# EAGLE design GERMO (EAGLE 9.4.2)
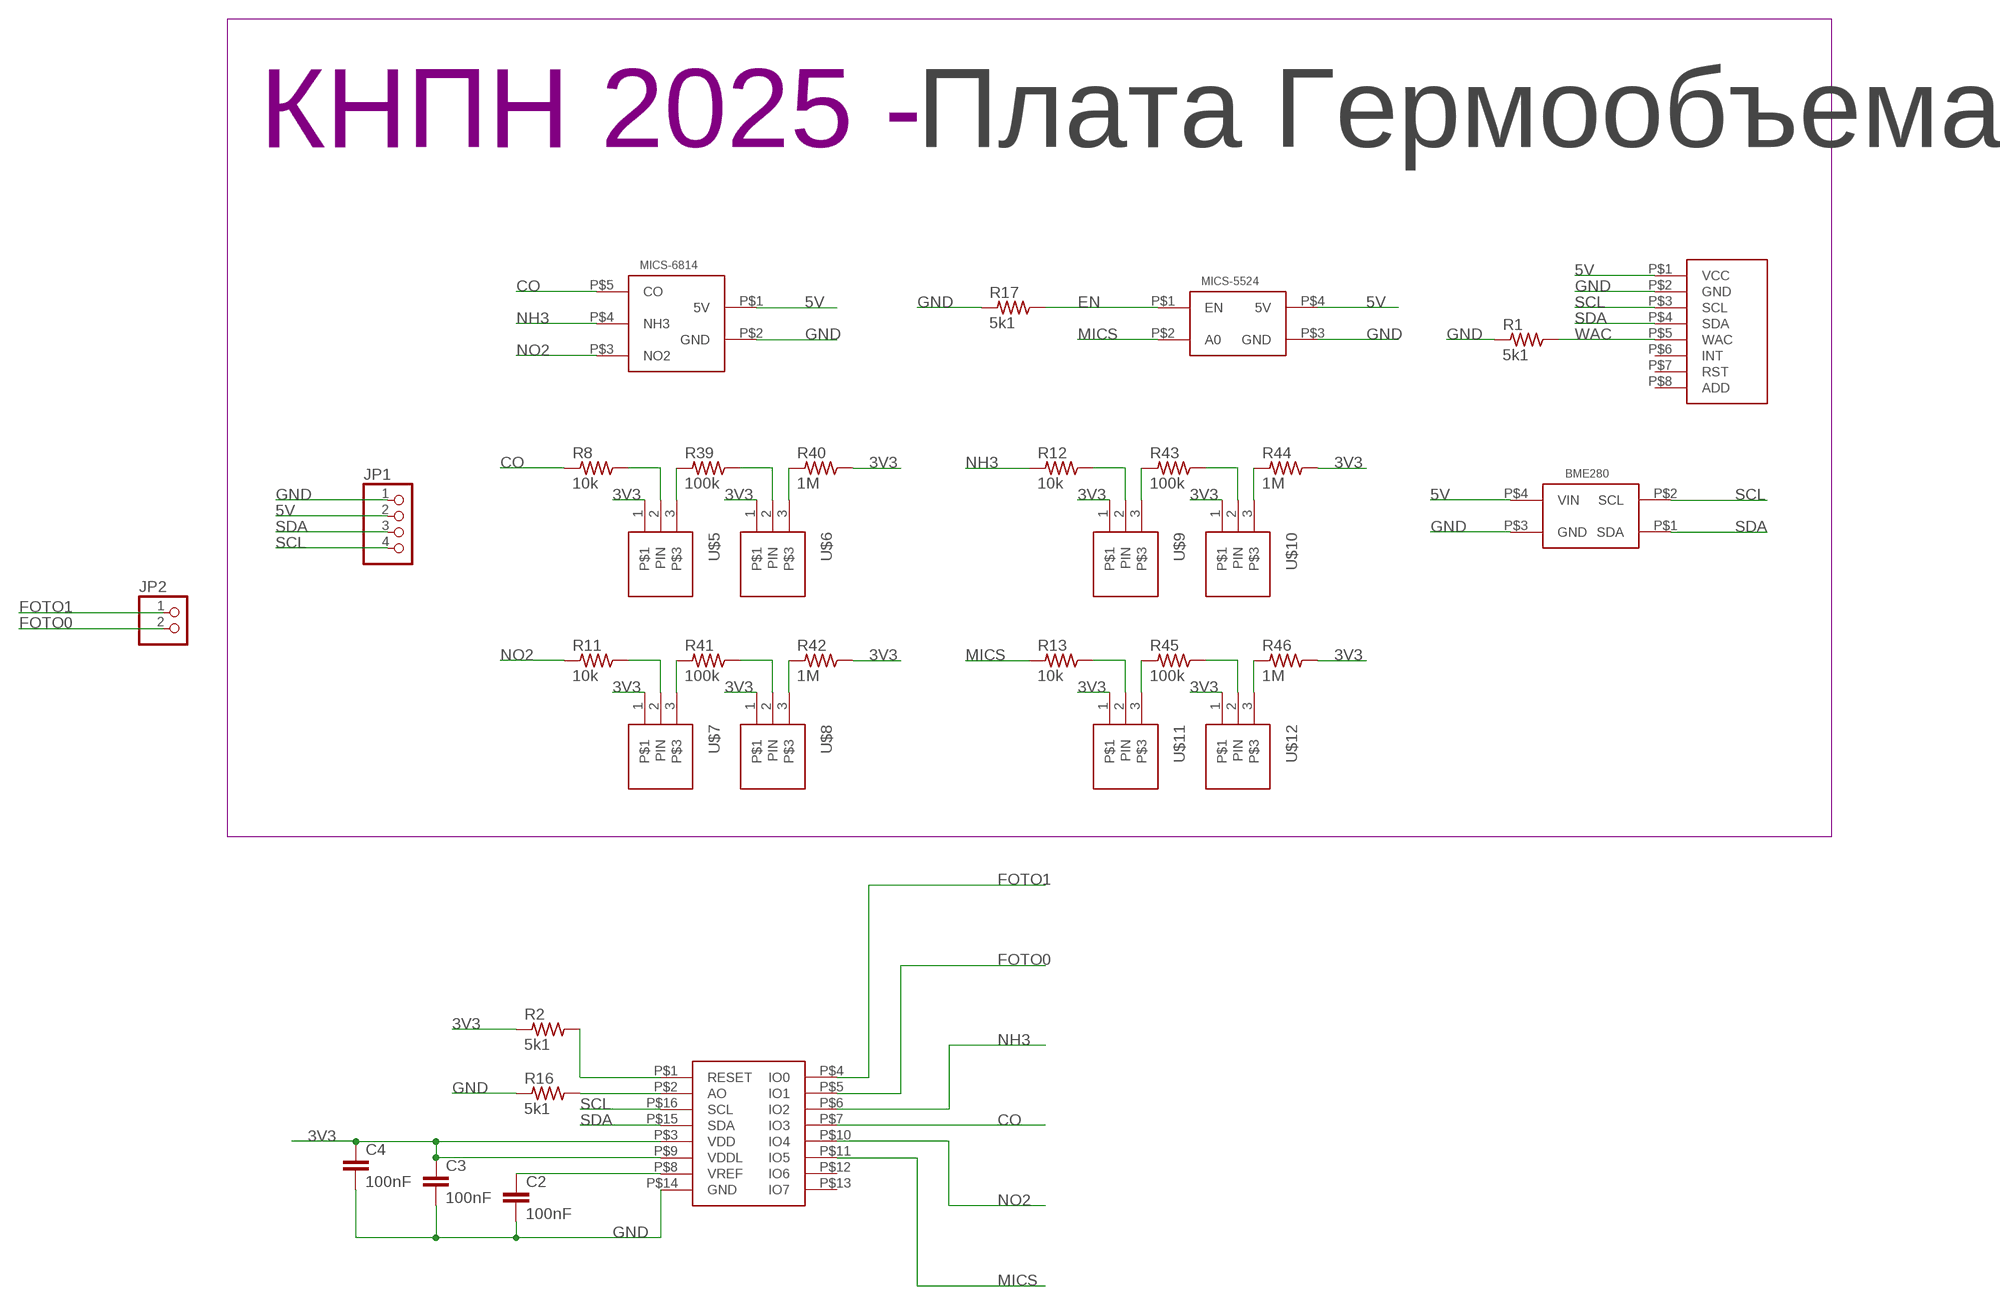
[diagram p0: schematic, sheet 1]

## Parts
BME280  BME280BME280-PINS-ONLY  [BME280-PINS-ONLY]
C2  100nF  C-EUC0603  [C0603]
C3  100nF  C-EUC0603  [C0603]
C4  100nF  C-EUC0603  [C0603]
CCS811  CCS811  [CSS811]
JP1  PINHD-1X4  [1X04]
JP2  PINHD-1X2  [1X02]
MICS-5524  MICS_5524  [MICS-5524]
MICS-6814  MICS-6814  [MICS-6814]
R1  5k1  R-US_R0603  [R0603]
R2  5k1  R-US_R0603  [R0603]
R8  10k  R-US_R0603  [R0603]
R11  10k  R-US_R0603  [R0603]
R12  10k  R-US_R0603  [R0603]
R13  10k  R-US_R0603  [R0603]
R16  5k1  R-US_R0603  [R0603]
R17  5k1  R-US_R0603  [R0603]
R39  100k  R-US_R0603  [R0603]
R40  1M  R-US_R0603  [R0603]
R41  100k  R-US_R0603  [R0603]
R42  1M  R-US_R0603  [R0603]
R43  100k  R-US_R0603  [R0603]
R44  1M  R-US_R0603  [R0603]
R45  100k  R-US_R0603  [R0603]
R46  1M  R-US_R0603  [R0603]
U$2  Плата Гермообъема  LOGOPCB-""  [LOGO]
U$5  CONNECT_3  [CONNECT_3]
U$6  CONNECT_3  [CONNECT_3]
U$7  CONNECT_3  [CONNECT_3]
U$8  CONNECT_3  [CONNECT_3]
U$9  CONNECT_3  [CONNECT_3]
U$10  CONNECT_3  [CONNECT_3]
U$11  CONNECT_3  [CONNECT_3]
U$12  CONNECT_3  [CONNECT_3]
U$14  AD5593  [AD5593]

## Nets
3V3: C3.1 C4.1 R2.2 R40.1 R42.1 R44.1 R46.1 U$5.1 U$6.1 U$7.1 U$8.1 U$9.1 U$10.1 U$11.1 U$12.1 U$14.P$3(VDD) U$14.P$9(VDDL)
5V: BME280.P$4(VIN) CCS811.P$1(VCC) JP1.2 MICS-5524.P$4(5V) MICS-6814.P$1(5V)
CO: MICS-6814.P$5(CO) R8.2 U$14.P$7(IO3)
EN: MICS-5524.P$1(EN) R17.1
FOTO0: JP2.2 U$14.P$5(IO1)
FOTO1: JP2.1 U$14.P$4(IO0)
GND: BME280.P$3(GND) C2.2 C3.2 C4.2 CCS811.P$2(GND) JP1.1 MICS-5524.P$3(GND) MICS-6814.P$2(GND) R1.2 R16.2 R17.2 U$14.P$14(GND)
MICS: MICS-5524.P$2(A0) R13.2 U$14.P$11(IO5)
N$1: R39.2 U$5.3
N$2: R8.1 U$5.2(PIN)
N$3: R40.2 U$6.3
N$4: R39.1 U$6.2(PIN)
N$5: R41.2 U$7.3
N$6: R11.1 U$7.2(PIN)
N$7: R42.2 U$8.3
N$8: R41.1 U$8.2(PIN)
N$9: R43.2 U$9.3
N$10: R12.1 U$9.2(PIN)
N$11: R44.2 U$10.3
N$12: R43.1 U$10.2(PIN)
N$13: R45.2 U$11.3
N$14: R13.1 U$11.2(PIN)
N$15: R46.2 U$12.3
N$16: R45.1 U$12.2(PIN)
N$18: C2.1 U$14.P$8(VREF)
N$19: R16.1 U$14.P$2(AO)
N$20: R2.1 U$14.P$1(RESET)
NH3: MICS-6814.P$4(NH3) R12.2 U$14.P$6(IO2)
NO2: MICS-6814.P$3(NO2) R11.2 U$14.P$10(IO4)
SCL: BME280.P$2(SCL) CCS811.P$3(SCL) JP1.4 U$14.P$16(SCL)
SDA: BME280.P$1(SDA) CCS811.P$4(SDA) JP1.3 U$14.P$15(SDA)
WAC: CCS811.P$5(WAC) R1.1
Unconnected: CCS811.P$6(INT) CCS811.P$7(RST) CCS811.P$8(ADD) U$14.P$12(IO6) U$14.P$13(IO7)

## Library data of the parts
BME280 = UNKNOWN-2024:BME280
C2-C4 = rcl:C-EU: CAPACITOR, European symbol; SPICEPREFIX: C
CCS811 = UNKNOWN-2024:CCS811
JP1 = pinhead:PINHD-1X4: PIN HEADER
JP2 = pinhead:PINHD-1X2: PIN HEADER
MICS-5524 = UNKNOWN-2024:MICS_5524
MICS-6814 = CanCubeSat:MICS-6814
R1 R2 R8 R11-R13 R16 R17 R39-R46 = rcl:R-US_: RESISTOR, American symbol; SPICEPREFIX: R
U$2 = UNKNOWN-2024:LOGO
U$5-U$12 = UNKNOWN-2024:CONNECT_3
U$14 = UNKNOWN-2024:AD5593

## Board
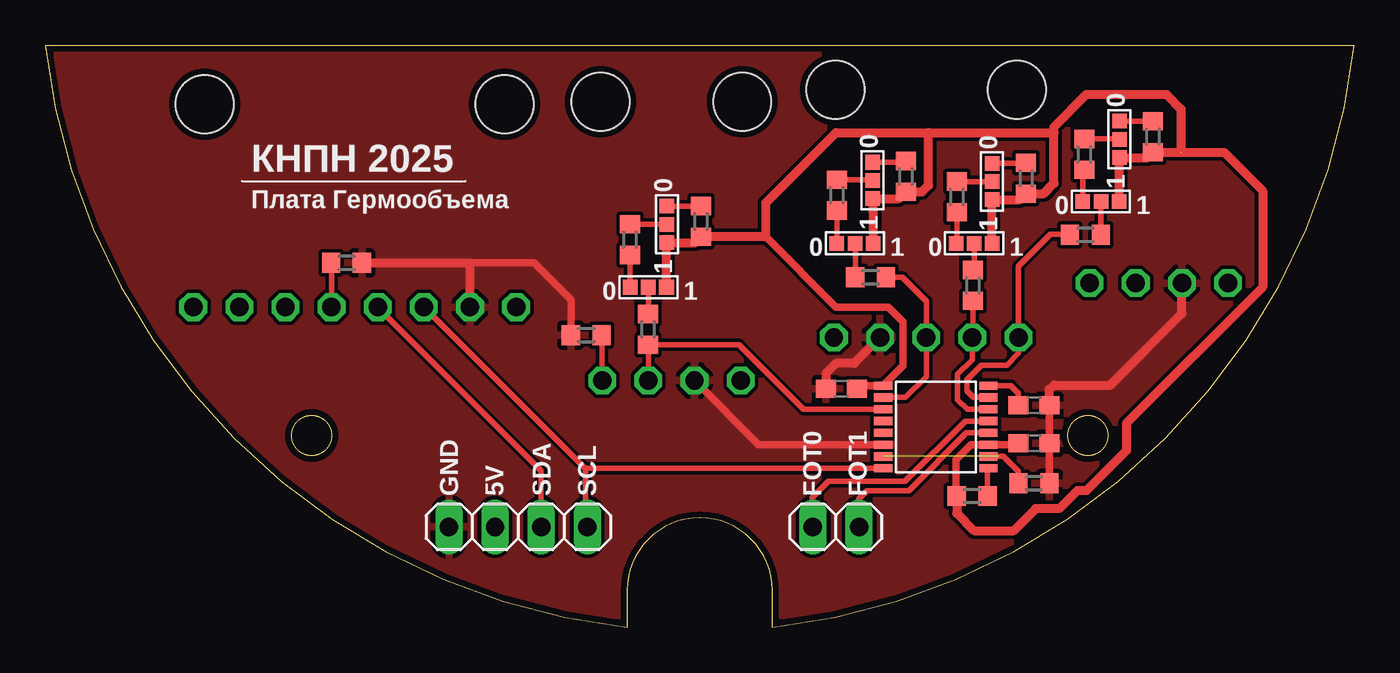
[diagram p1: board, top side]
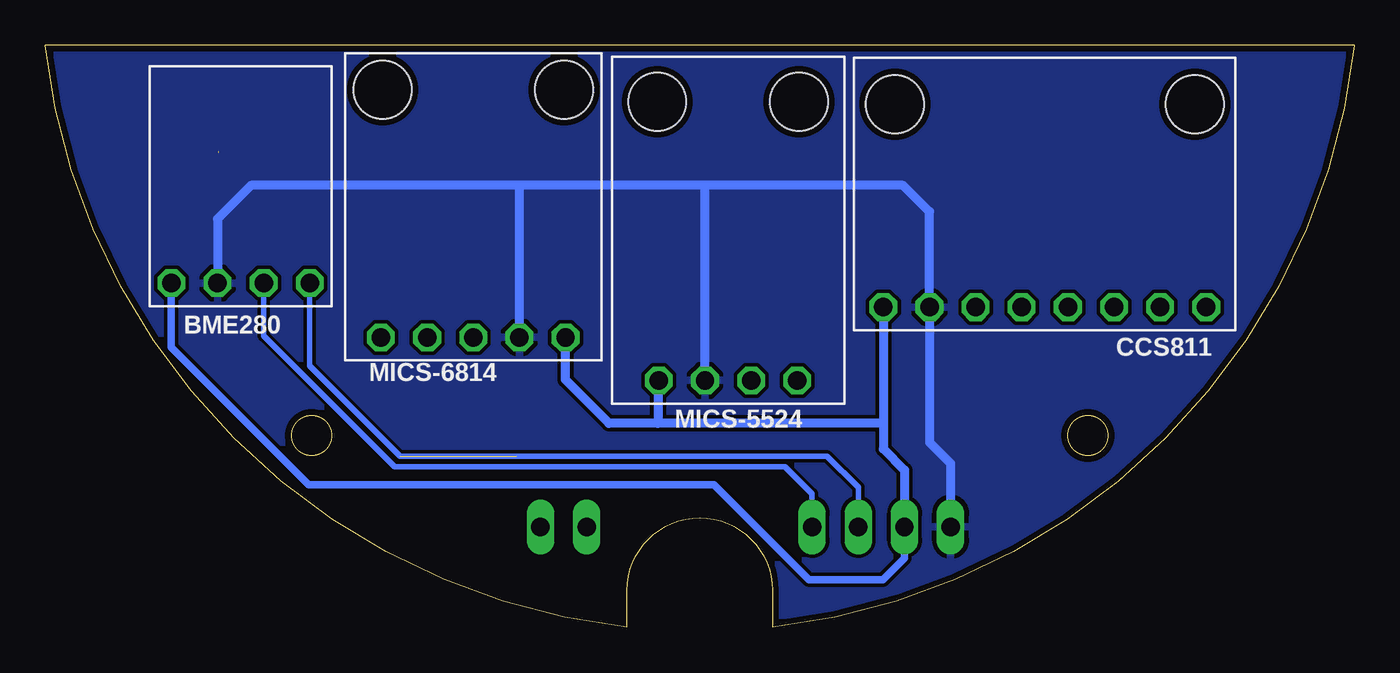
[diagram p2: board, bottom side, seen from below]

Size 72.06 x 32.03 mm. Coordinates in mm from the lower left corner, seen from the top.
Outline: 32.03,2.03 32.03,0 arc-77 0,32.03 72.06,32.03 arc-77 40.03,0 40.03,2.03 arc180 32.03,2.03
Outline: circle at 14.66,10.56 radius 1.1
Outline: circle at 57.4,10.56 radius 1.1
Copper layers (1*16): Top 0.035mm / dielectric 1.5mm / Bottom 0.035mm
Design rules "default *": minimum track width 0.3mm, minimum drill 0.35mm, track to track 0.2mm, track to pad 0.2mm, pad to pad 0.2mm, via to via 0.2mm, smd to smd 0.2mm, copper to edge 0.35mm, drill to drill 0.2mm, minimum pad ring 10mil, minimum via ring 8mil, stop-mask expansion 4mil, vias tented up to drill 0mil, thermal gap 10mil

### Footprints (pad centres in the part's own frame; a part is rotated, then mirrored left to right if it is on the bottom)
BME280-PINS-ONLY = drill 1.016 octagon: P$1 -3.81,5.33; P$2 -1.27,5.33; P$3 1.27,5.33; P$4 3.81,5.33
C0603 = smd 1.1 x 1: 1 -0.85,0; 2 0.85,0
CSS811 = drill 1.016 octagon: P$1 6.23,-8.89; P$2 6.23,-6.35; P$3 6.23,-3.81; P$4 6.23,-1.27; P$5 6.23,1.27; P$6 6.23,3.81; P$7 6.23,6.35; P$8 6.23,8.89 | hole 3.2: -4.95,-8.25; -4.95,8.25
1X04 = drill 1.016 long: 1 -3.81,0; 2 -1.27,0; 3 1.27,0; 4 3.81,0
1X02 = drill 1.016 long: 1 -1.27,0; 2 1.27,0
MICS-5524 = drill 1.016 octagon: P$1 -3.81,8.28; P$2 -1.27,8.28; P$3 1.27,8.28; P$4 3.81,8.28 | hole 3.2: -3.9,-7.05; 3.9,-7.05
MICS-6814 = drill 1.016 octagon: P$1 -5.08,7.18; P$2 -2.54,7.18; P$3 0,7.18; P$4 2.54,7.18; P$5 5.08,7.18 | hole 3.2: -5,-6.45; 5,-6.45
R0603 = smd 1 x 1.1: 1 -0.85,0; 2 0.85,0
CONNECT_3 = smd 0.8 x 0.8: 1 1,0; 2 0,0; 3 -1,0
AD5593 = smd 0.45 x 1: P$1 -2.275,-2.9; P$2 -1.625,-2.9; P$3 -0.975,-2.9; P$4 -0.325,-2.9; P$5 0.325,-2.9; P$6 0.975,-2.9; P$7 1.625,-2.9; P$8 2.275,-2.9; P$9 2.275,2.9; P$10 1.625,2.9; P$11 0.975,2.9; P$12 0.325,2.9; P$13 -0.325,2.9; P$14 -0.975,2.9; P$15 -1.625,2.9; P$16 -2.275,2.9

### Placement (x,y rotation side)
BME280  61.31,24.28 180 bottom
C2  54.43,12.23 0 top
C3  54.43,10.13 0 top
C4  43.83,13.13 180 top
CCS811  17.03,23.85 270 bottom
JP1  26.03,5.53 0 top
JP2  43.53,5.53 180 top
MICS-5524  34.47,21.87 180 bottom
MICS-6814  48.5,23.14 180 bottom
R1  16.58,20.06 0 top
R2  51.03,7.23 180 top
R8  57.26,21.6 180 top
R11  45.44,19.26 0 top
R12  51.08,18.82 270 top
R13  33.18,16.4 270 top
R16  54.43,7.93 0 top
R17  29.78,16.08 180 top
R39  57.2,26.03 270 top
R40  60.98,27 90 top
R41  43.58,23.79 270 top
R42  47.38,24.82 90 top
R43  50.18,23.69 270 top
R44  54,24.72 90 top
R45  32.18,21.34 270 top
R46  36.1,22.34 90 top
U$2  10.83,24.56 0 top
U$5  58.12,23.44 0 top
U$6  59.14,26.86 270 top
U$7  44.58,21.14 0 top
U$8  45.54,24.6 270 top
U$9  51.14,21.14 0 top
U$10  52.12,24.54 270 top
U$11  33.2,18.72 0 top
U$12  34.22,22.18 270 top
U$14  49.03,11.03 90 top

### Tracks (layer width: path | path; a pad name or v marks a point on that pad's centre or on a via)
3V3  (1 unrouted)
  Top 0.4: R2.2 50.13,7.28 50.13,9.23 50.95,10.05 U$14.P$3 53.5,10.05 C3.1 | C4.1 44.85,13.3 U$14.P$9 47.23,14.4 47.23,16.83 46.43,17.63 43.53,17.63 39.67,21.49
  Top 0.5: U$5.1 59.14,23.46 U$6.1 60.69,25.86 R40.1 62.55,26.15 | U$9.1 52.12,21.16 U$10.1 53.67,23.54 R44.1 54.97,23.87 55.53,24.43 55.53,27.23 | U$7.1 45.58,23.56 U$8.1 47.01,23.6 R42.1 48.27,23.97 48.63,24.33 48.63,27.23 | U$11.1 34.2,21.16 U$12.1 35.79,21.18 R46.1 39.67,21.49 39.67,23.37 43.53,27.23 48.63,27.23 | 55.53,27.23 55.53,27.53 57.33,29.33 61.73,29.33 62.53,28.53 62.53,26.15 64.91,26.15 67.03,24.03 67.03,18.73 59.53,11.23 59.53,9.73 57.33,7.53 56.83,7.53 55.83,6.53 54.53,6.53 53.33,5.33 51.13,5.33 50.18,6.28 R2.2 | 48.63,27.23 55.53,27.23
5V
  Bottom 0.4: BME280.P$4 65.12,15.42 57.55,7.85 35.25,7.85 30.03,2.63 25.93,2.63 24.76,3.8 JP1.2
  Bottom 0.5: CCS811.P$1 25.92,11.23 | 25.92,11.23 25.92,9.82 24.76,8.66 JP1.2 | 25.92,11.23 38.33,11.23 | 38.33,11.23 41.03,11.23 43.43,13.63 MICS-6814.P$1 | MICS-5524.P$4 38.33,13.54 38.33,11.23
CO
  Top 0.3: U$14.P$7 51.1,12.65 50.73,13.03 50.73,13.63 51.53,14.43 52.93,14.43 53.58,15.08 MICS-6814.P$5 53.58,19.88 55.33,21.63 56.38,21.63 R8.2
EN
  Top 0.3: MICS-5524.P$1 30.66,16.05 R17.1
FOTO0
  Top 0.3: U$14.P$5 50.65,11.35 47.33,8.03 43.13,8.03 42.22,7.12 JP2.2
FOTO1
  Top 0.3: U$14.P$4 50.71,10.7 47.54,7.53 45.23,7.53 44.76,7.06 JP2.1
GND
  Top 0.4: R16.2 C3.2 C2.2 | U$14.P$14 39.27,10.05 MICS-5524.P$3 | 23.33,20.06 26.9,20.06 28.93,18.03 R17.2
  Top 0.5: R1.2 23.33,20.06 23.38,20.01 CCS811.P$2 | C2.2 55.28,13.08 55.53,13.33 58.63,13.33 62.58,17.28 BME280.P$3 | MICS-6814.P$2 44.53,14.53 43.53,14.53 42.98,13.98 C4.2
  Bottom 0.5: JP1.1 22.22,9.02 23.38,10.18 CCS811.P$2 23.38,22.88 24.83,24.33 35.73,24.33 | 35.73,24.33 46.13,24.33 | 46.13,24.33 60.73,24.33 62.58,22.48 BME280.P$3 | MICS-5524.P$3 35.74,24.32 35.73,24.33 | MICS-6814.P$2 45.96,24.16 46.13,24.33
  pour Bottom: -1.47,33.93 -1.47,-2.57 73.43,-2.57 73.43,33.93
  pour Top: -1.17,33.83 -1.17,-2.67 73.73,-2.67 73.73,33.83
MICS
  Top 0.3: U$14.P$11 41.73,12 38.18,15.55 R13.2 33.2,15.53 MICS-5524.P$2
N$1
  Top 0.3: U$5.3 57.12,25.1 R39.2
N$2
  Top 0.3: U$5.2 R8.1
N$3
  Top 0.3: U$6.3 R40.2
N$4
  Top 0.3: R39.1 59.12,26.88 U$6.2
N$5
  Top 0.3: U$7.3 R41.2
N$6
  Top 0.3: R11.1 U$7.2
N$7
  Top 0.3: U$8.3 47.31,25.6 R42.2
N$8
  Top 0.3: R41.1 45.5,24.64 U$8.2
N$9
  Top 0.3: R43.2 50.18,21.18 U$9.3
N$10
  Top 0.3: U$9.2 51.14,19.73 R12.1
N$11
  Top 0.3: U$10.3 53.97,25.54 R44.2
N$12
  Top 0.3: R43.1 U$10.2
N$13
  Top 0.3: U$11.3 32.2,20.47 R45.2
N$14
  Top 0.3: U$11.2 33.2,17.27 R13.1
N$15
  Top 0.3: U$12.3 R46.2
N$16
  Top 0.3: R45.1 U$12.2
N$18
  Top 0.3: U$14.P$8 53.15,13.3 53.58,12.88 C2.1
N$19
  Top 0.3: U$14.P$2 52.75,9.4 53.58,8.58 R16.1
N$20
  Top 0.3: R2.1 51.88,8.7 U$14.P$1
NH3
  Top 0.3: R12.2 51.08,16 MICS-6814.P$4 51.04,14.74 50.23,13.93 50.23,12.53 50.75,12 U$14.P$6
NO2
  Top 0.3: U$14.P$10 47.35,12.65 48.5,13.8 MICS-6814.P$3 48.5,17.96 47.2,19.26 R11.2
SCL
  Top 0.3: U$14.P$16 29.74,8.75 | 29.74,8.75 29.74,5.63 JP1.4 | CCS811.P$3 29.7,8.75 29.74,8.75
  Bottom 0.3: BME280.P$2 60.04,16.04 52.83,8.83 31.33,8.83 29.84,7.34 JP1.4
SDA  (1 unrouted)
  Top 0.3: CCS811.P$4 27.3,8.62 JP1.3
  Bottom 0.3: BME280.P$1 57.5,14.4 52.53,9.43 29.03,9.43 27.3,7.7 JP1.3
WAC
  Top 0.3: CCS811.P$5 15.76,20.03 R1.1

### Text on the board
tNames: GND | 5V | SDA | SCL | FOT0 | FOT1